# EAGLE design easyface (EAGLE 5.12)

## Sheet 1 of 2
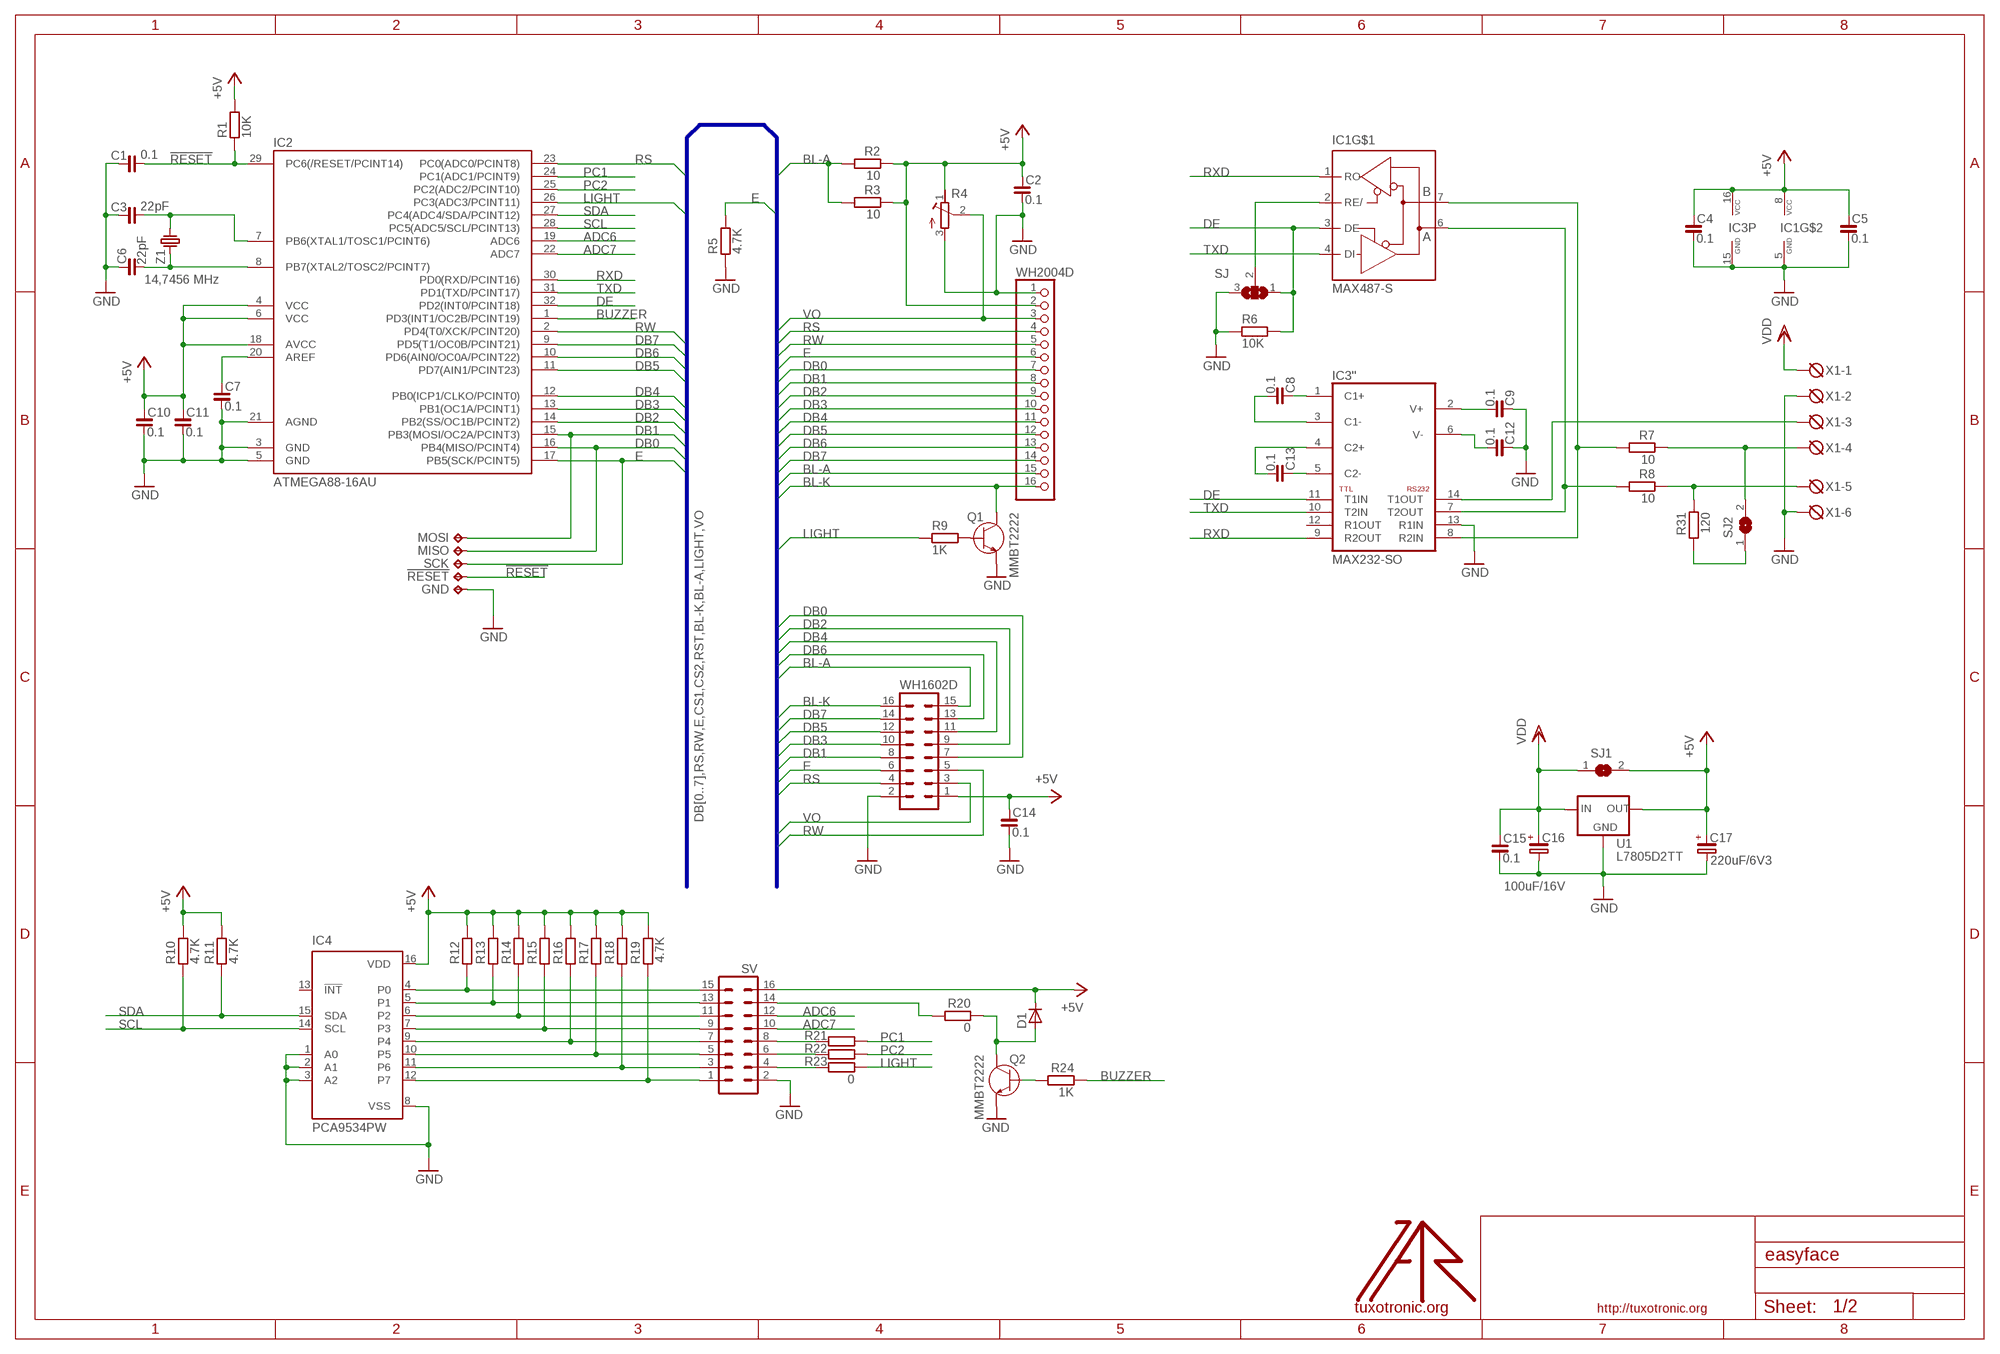
[diagram p0: schematic, sheet 1]

### Parts
!RESET  TPB1,27  [B1,27]
C1  0.1  C_0805  [C0805]
C2  0.1  C_0805  [C0805]
C3  22pF  C_0805  [C0805]
C4  0.1  C_0805  [C0805]
C5  0.1  C_0805  [C0805]
C6  22pF  C_0805  [C0805]
C7  0.1  C_0805  [C0805]
C8  0.1  C_0805  [C0805]
C9  0.1  C_0805  [C0805]
C10  0.1  C_0805  [C0805]
C11  0.1  C_0805  [C0805]
C12  0.1  C_0805  [C0805]
C13  0.1  C_0805  [C0805]
C14  0.1  C_0805  [C0805]
C15  0.1  C_0805  [C0805]
C16  100uF/16V  CP_SMCD  [SMC_D]
C17  220uF/6V3  CP_SMCD  [SMC_D]
D1  D-SOD-80  [SOD80]
GND  TPB1,27  [B1,27]
IC1  MAX487-S  [SO08]
IC2  ATMEGA88-16AU  MEGA48/88/168-AU  [TQFP32-08]
IC3  MAX232-SO  [SO16]
IC4  PCA9534PW  [SSOP16]
MISO  TPB1,27  [B1,27]
MOSI  TPB1,27  [B1,27]
Q1  MMBT2222  BC847C  [SOT23]
Q2  MMBT2222  BC847C  [SOT23]
R1  10K  R_0805  [R0805]
R2  10  R_0805  [R0805]
R3  10  R_0805  [R0805]
R4  RTRIM  [RTRIM-3362P]
R5  4.7K  R_0805  [R0805]
R6  10K  R_0805  [R0805]
R7  10  R_0805  [R0805]
R8  10  R_0805  [R0805]
R9  1K  R_0805  [R0805]
R10  4.7K  R_0805  [R0805]
R11  4.7K  R_0805  [R0805]
R12  4.7K  R_0805  [R0805]
R13  4.7K  R_0805  [R0805]
R14  4.7K  R_0805  [R0805]
R15  4.7K  R_0805  [R0805]
R16  4.7K  R_0805  [R0805]
R17  4.7K  R_0805  [R0805]
R18  4.7K  R_0805  [R0805]
R19  4.7K  R_0805  [R0805]
R20  0  R_0805  [R0805]
R21  0  R_0805  [R0805]
R22  0  R_0805  [R0805]
R23  0  R_0805  [R0805]
R24  1K  R_0805  [R0805]
R31  120  R_0805  [R0805]
SCK  TPB1,27  [B1,27]
SJ  SJ2W  [SJ_2]
SJ1  SJ  [SJ]
SJ2  SJ  [SJ]
SV  ML16L  [ML16L]
U1  L7805D2TT  L78D2TT  [D2PAK]
U$  LOGO  [TT_LOGO]
WH1602D  MA08-2  [MA08-2]
WH2004D  PINHD-1X16_2.54-RND  [1X16RND]
X1  DG3XX-06-3.5  [DG350-3.5-06P]
Z1  14,7456 MHz  CRYSTAL-HC49S  [HC49/S]

### Nets
!RESET: !RESET.PP(TP) C1.2 IC2.29(PC6(/RESET/PCINT14)) R1.1
+5V: C2.1 C4.1 C5.1 C10.1 C11.1 C14.1 C17.+ D1.C IC1.8(VCC) IC2.4(VCC) IC2.6(VCC) IC2.18(AVCC) IC3.16(P:VCC) IC4.16(VDD) R1.2 R2.1 R3.1 R4.1(A) R10.2 R11.2 R12.2 R13.2 R14.2 R15.2 R16.2 R17.2 R18.2 R19.2 SJ1.2 SV.16 U1.3(OUT) WH1602D.1 WH2004D.2
ADC6: IC2.19(ADC6) SV.12
ADC7: IC2.22(ADC7) SV.10
BL-A: R2.2 R3.2 WH1602D.15 WH2004D.15
BL-K: Q1.3(C) WH1602D.16 WH2004D.16
BUZZER: IC2.1(PD3(INT1/OC2B/PCINT19)) R24.1
DB0: IC2.16(PB4(MISO/PCINT4)) MISO.PP(TP) WH1602D.7 WH2004D.7
DB1: IC2.15(PB3(MOSI/OC2A/PCINT3)) MOSI.PP(TP) WH1602D.8 WH2004D.8
DB2: IC2.14(PB2(SS/OC1B/PCINT2)) WH1602D.9 WH2004D.9
DB3: IC2.13(PB1(OC1A/PCINT1)) WH1602D.10 WH2004D.10
DB4: IC2.12(PB0(ICP1/CLKO/PCINT0)) WH1602D.11 WH2004D.11
DB5: IC2.11(PD7(AIN1/PCINT23)) WH1602D.12 WH2004D.12
DB6: IC2.10(PD6(AIN0/OC0A/PCINT22)) WH1602D.13 WH2004D.13
DB7: IC2.9(PD5(T1/OC0B/PCINT21)) WH1602D.14 WH2004D.14
DE: IC1.3(DE) IC2.32(PD2(INT0/PCINT18)) IC3.11('':T1IN) R6.2 SJ.1
E: IC2.17(PB5(SCK/PCINT5)) R5.2 SCK.PP(TP) WH1602D.6 WH2004D.6
GND: C1.1 C2.2 C3.1 C4.2 C5.2 C6.1 C7.2 C9.1 C10.2 C11.2 C12.1 C14.2 C15.2 C16.- C17.- GND.PP(TP) IC1.5(GND) IC2.3(GND) IC2.5(GND) IC2.21(AGND) IC3.13('':R1IN) IC3.15(P:GND) IC4.1(A0) IC4.2(A1) IC4.3(A2) IC4.8(VSS) Q1.2(E) Q2.2(E) R4.3(E) R5.1 R6.1 SJ.3 SV.2 U1.2(GND) WH1602D.2 WH2004D.1 X1.2 X1.6 ; also sheet 2
LIGHT: IC2.26(PC3(ADC3/PCINT11)) R9.1 R23.1
N$1: R7.1 SJ2.2 X1.4
N$2: IC4.4(P0) R12.1 SV.15
N$3: C7.1 IC2.20(AREF)
N$4: IC1.2(RE/) SJ.2
N$5: IC4.5(P1) R13.1 SV.13
N$6: Q2.1(B) R24.2
N$7: IC4.6(P2) R14.1 SV.11
N$8: R20.2 SV.14
N$9: D1.A Q2.3(C) R20.1
N$10: IC4.7(P3) R15.1 SV.9
N$11: Q1.1(B) R9.2
N$12: IC4.9(P4) R16.1 SV.7
N$13: IC4.10(P5) R17.1 SV.5
N$14: IC4.11(P6) R18.1 SV.3
N$15: IC4.12(P7) R19.1 SV.1
N$16: C3.2 IC2.7(PB6(XTAL1/TOSC1/PCINT6)) Z1.2
N$17: R8.1 R31.1 X1.5
N$18: R21.2 SV.8
N$19: R22.2 SV.6
N$20: R23.2 SV.4
N$22: R31.2 SJ2.1
N$51: C12.2 IC3.6('':V-)
N$52: C9.2 IC3.2('':V+)
N$55: C13.1 IC3.5('':C2-)
N$56: C13.2 IC3.4('':C2+)
N$57: C8.2 IC3.3('':C1-)
N$58: C8.1 IC3.1('':C1+)
N$63: IC1.6(A) IC3.7('':T2OUT) R8.2
N$64: IC1.7(B) IC3.8('':R2IN) R7.2
N$65: IC3.14('':T1OUT) X1.3
PC1: IC2.24(PC1(ADC1/PCINT9)) R21.1
PC2: IC2.25(PC2(ADC2/PCINT10)) R22.1
RS: IC2.23(PC0(ADC0/PCINT8)) WH1602D.4 WH2004D.4
RW: IC2.2(PD4(T0/XCK/PCINT20)) WH1602D.5 WH2004D.5
RXD: IC1.1(RO) IC2.30(PD0(RXD/PCINT16)) IC3.9('':R2OUT)
SCL: IC2.28(PC5(ADC5/SCL/PCINT13)) IC4.14(SCL) R10.1
SDA: IC2.27(PC4(ADC4/SDA/PCINT12)) IC4.15(SDA) R11.1
TXD: IC1.4(DI) IC2.31(PD1(TXD/PCINT17)) IC3.10('':T2IN)
VDD: C15.1 C16.+ SJ1.1 U1.1(IN) X1.1
VO: R4.2(S) WH1602D.3 WH2004D.3
XTAL2: C6.2 IC2.8(PB7(XTAL2/TOSC2/PCINT7)) Z1.1
Unconnected: IC3.12('':R1OUT) IC4.13(!INT)

### Buses
DB[0..7],RS,RW,E,CS1,CS2,RST,BL-K,BL-A,LIGHT,VO

## Sheet 2 of 2
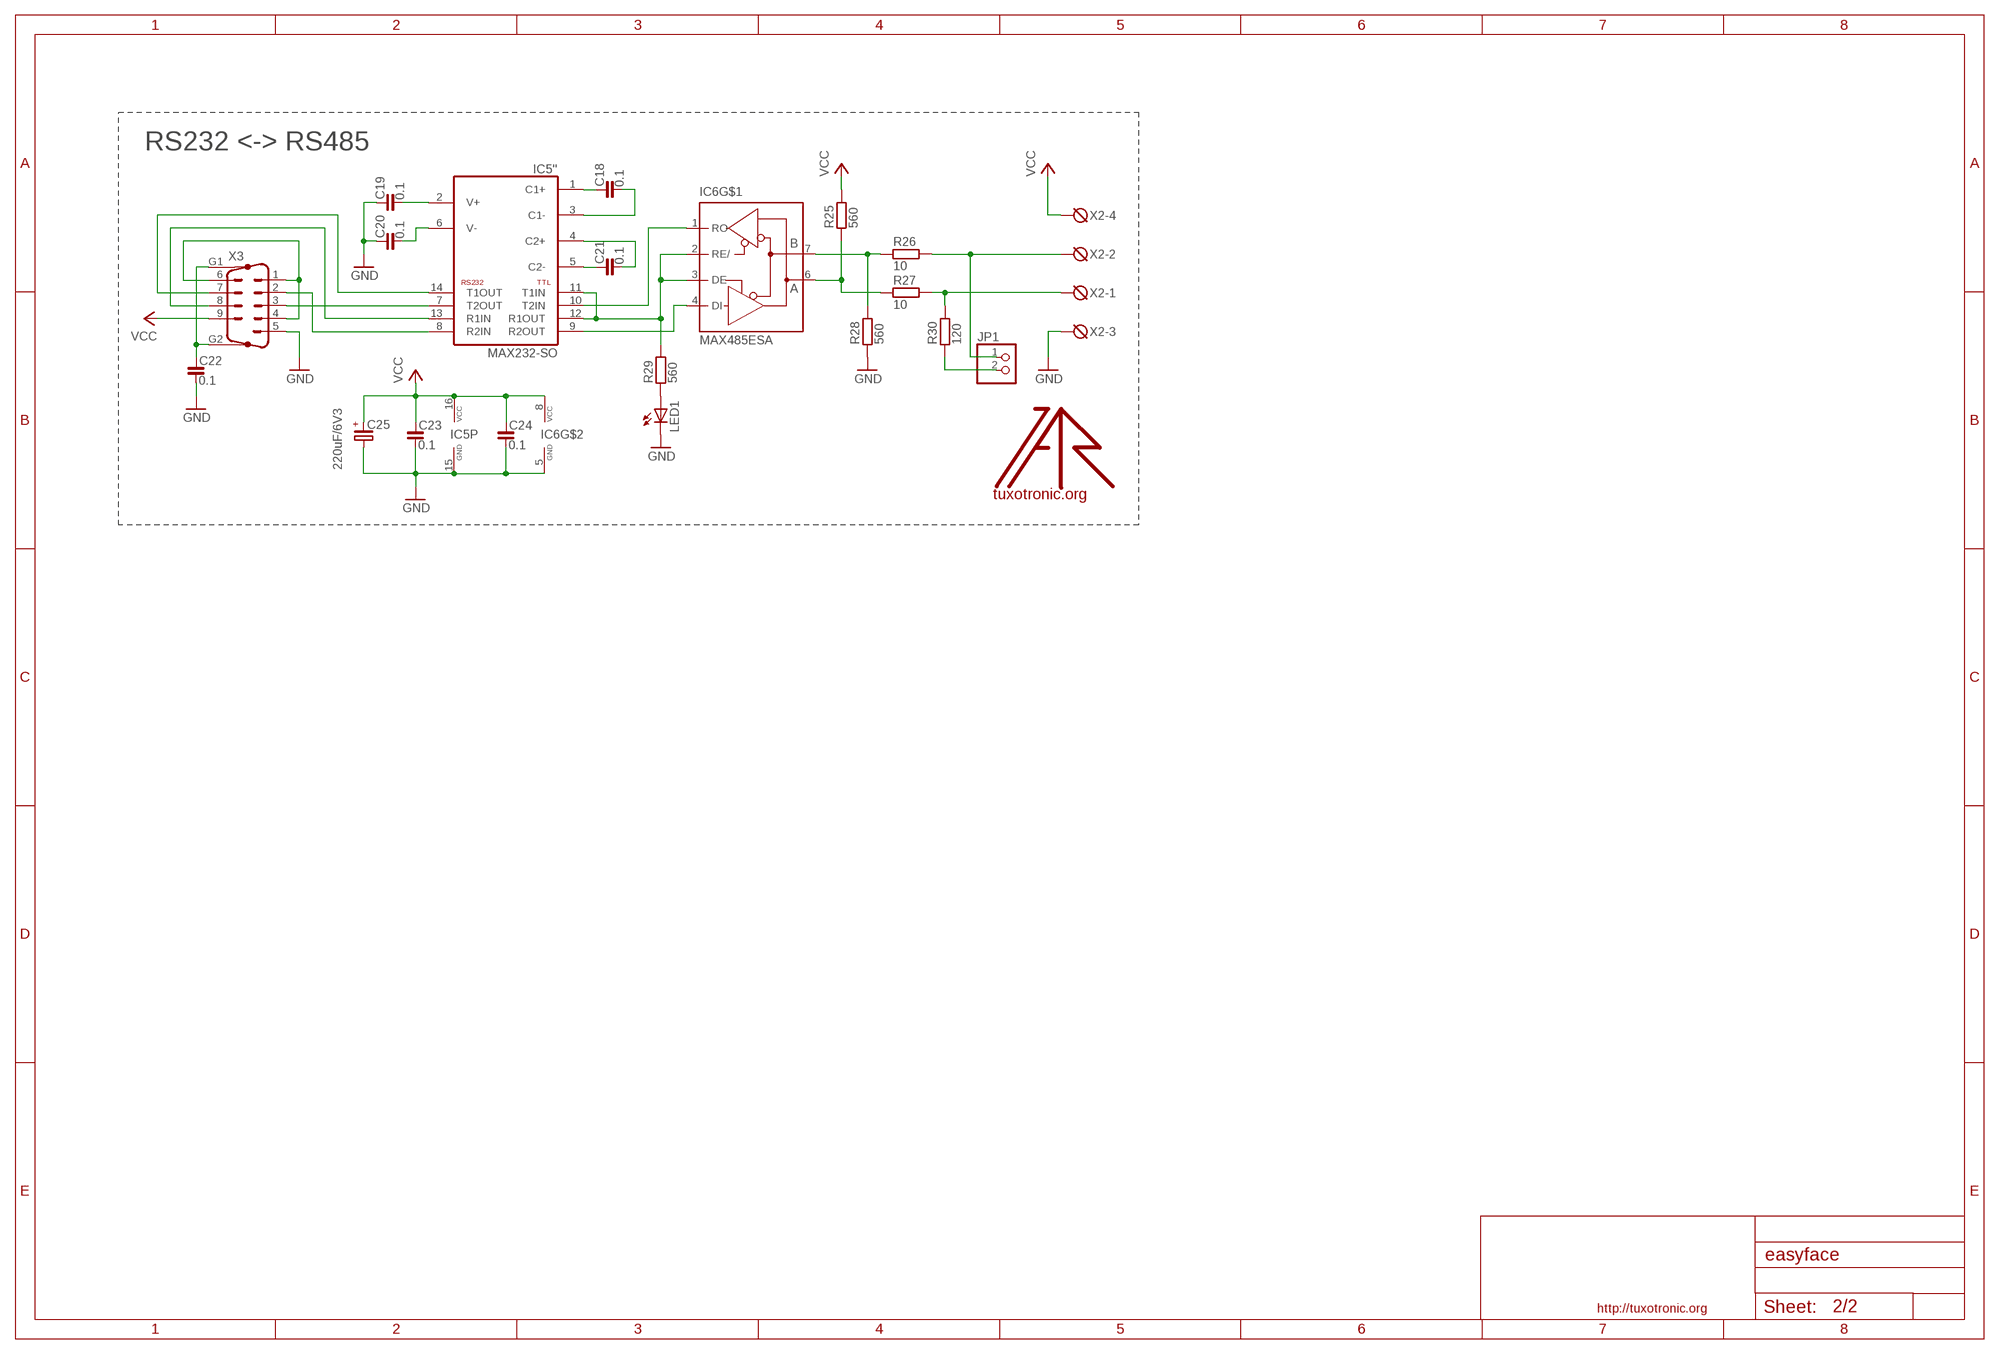
[diagram p1: schematic, sheet 2]

### Parts
C18  0.1  C_0805  [C0805]
C19  0.1  C_0805  [C0805]
C20  0.1  C_0805  [C0805]
C21  0.1  C_0805  [C0805]
C22  0.1  C_1206  [C1206]
C23  0.1  C_0805  [C0805]
C24  0.1  C_0805  [C0805]
C25  220uF/6V3  CP_SMCD  [SMC_D]
IC5  MAX232-SO  [SO16]
IC6  MAX485ESA  MAX487-S  [SO08]
JP1  PINHD-1X2_2.54  [1X02]
LED1  LEDCHIP-LED0805  [CHIP-LED0805]
R25  560  R_0805  [R0805]
R26  10  R_0805  [R0805]
R27  10  R_0805  [R0805]
R28  560  R_0805  [R0805]
R29  560  R_0805  [R0805]
R30  120  R_0805  [R0805]
U$1  LOGO  [TT_LOGO]
X2  DG3XX-04-3.5  [DG350-3.5-04P]
X3  M09HP-9.4  [M09HP]

### Nets
GND: C19.1 C20.1 C22.2 C23.2 C24.2 C25.- IC5.15(P:GND) IC6.5(GND) LED1.C R28.1 X2.3 X3.5 ; also sheet 1
N$21: JP1.2 R30.1
N$31: IC5.7('':T2OUT) X3.3
N$32: C20.2 IC5.6('':V-)
N$33: C19.2 IC5.2('':V+)
N$34: C22.1 X3.G1 X3.G2
N$35: X3.1 X3.4 X3.6
N$36: C21.1 IC5.5('':C2-)
N$37: C21.2 IC5.4('':C2+)
N$38: C18.2 IC5.3('':C1-)
N$39: C18.1 IC5.1('':C1+)
N$40: IC6.7(B) R26.1 R28.2
N$41: IC6.6(A) R25.1 R27.1
N$42: JP1.1 R26.2 X2.2
N$43: R27.2 R30.2 X2.1
N$44: IC5.8('':R2IN) X3.2
N$45: IC5.14('':T1OUT) X3.7
N$46: IC5.13('':R1IN) X3.8
N$48: IC5.9('':R2OUT) IC6.4(DI)
N$49: IC5.10('':T2IN) IC6.1(RO)
N$50: LED1.A R29.1
N$71: IC5.11('':T1IN) IC5.12('':R1OUT) IC6.2(RE/) IC6.3(DE) R29.2
VCC: C23.1 C24.1 C25.+ IC5.16(P:VCC) IC6.8(VCC) R25.2 X2.4 X3.9

### Notes on the sheet
- RS232 <-> RS485

## Library data of the parts
!RESET GND MISO MOSI SCK = testpad:TP: Test pad
C1-C15 C18-C24 = rc-master-smd:C_: NON-POLARIZED CAP
C16 C17 C25 = rc-master-smd:CP_: POLARIZED CAP
D1 = diodes:D-: DIODE
IC1 = interfaces:MAX487: RS485 TRANSEIVER
IC2 = avr-6:MEGA48/88/168
IC3 IC5 = rs232-rs485:MAX232: RS232 TRANSEIVER
IC4 = micro-philips:PCA9534: 8-bit I2C-bus and SMBus low power I/O port with interrupt
IC6 = rs232-rs485:MAX487: RS485 TRANSEIVER
JP1 = pinhead-fixdrills:PINHD-1X2: PIN HEADER
LED1 = led:LED: LED OSRAM: - CHIPLED LG R971, LG N971, LY N971, LG Q971, LY Q971, LO R971, LY R971 LH N974, LH R974 LS Q976, LO Q976, LY Q976 LO Q996 - Hyper CHIPLED LW Q18S LB Q993, LB Q99A, LB R99A - SideLED LS A670, LO A670, LY A670, LG A670, LP A670 LB A673, LV A673, LT A673, LW A673 LH A674 LY A675 LS A676, LA A676, LO A676, LY A676, LW A676 LS A679, LY A679, LG A679 - Hyper Micro SIDELED® LS Y876, LA Y876, LO Y876, LY Y876 LT Y87S - SmartLED LW L88C, LW L88S LB L89C, LB L89S, LG L890 LS L89K, LO L89K, LY L89K LS L896, LA L896, LO L896, LY L896 - TOPLED LS T670, LO T670, LY T670, LG T670, LP T670 LSG T670, LSP T670, LSY T670, LOP T670, LYG T670 LG T671, LOG T671, LSG T671 LB T673, LV T673, LT T673, LW T673 LH T674 LS T676, LA T676, LO T676, LY T676, LB T676, LH T676, LSB T676, LW T676 LB T67C, LV T67C, LT T67C, LS T67K, LO T67K, LY T67K, LW E67C LS E67B, LA E67B, LO E67B, LY E67B, LB E67C, LV E67C, LT E67C LW T67C LS T679, LY T679, LG T679 LS T770, LO T770, LY T770, LG T770, LP T770 LB T773, LV T773, LT T773, LW T773 LH T774 LS E675, LA E675, LY E675, LS T675 LS T776, LA T776, LO T776, LY T776, LB T776 LHGB T686 LT T68C, LB T68C - Hyper Mini TOPLED® LB M676 - Mini TOPLED Santana® LG M470 LS M47K, LO M47K, LY M47K Source: http://www.osram.convergy.de - LUMILED® LXK2-PW12-R00, LXK2-PW12-S00, LXK2-PW14-U00, LXK2-PW14-V00 LXK2-PM12-R00, LXK2-PM12-S00, LXK2-PM14-U00 LXK2-PE12-Q00, LXK2-PE12-R00, LXK2-PE12-S00, LXK2-PE14-T00, LXK2-PE14-U00 LXK2-PB12-K00, LXK2-PB12-L00, LXK2-PB12-M00, LXK2-PB14-N00, LXK2-PB14-P00, LXK2-PB14-Q00 LXK2-PR12-L00, LXK2-PR12-M00, LXK2-PR14-Q00, LXK2-PR14-R00 LXK2-PD12-Q00, LXK2-PD12-R00, LXK2-PD12-S00 LXK2-PH12-R00, LXK2-PH12-S00 LXK2-PL12-P00, LXK2-PL12-Q00, LXK2-PL12-R00 Source: www.luxeon.com
Q1 Q2 = semiconductor:BC847: Bipolar transistor NPN-structure
R1-R3 R5-R31 = rc-master-smd:R_: RESISTOR
R4 = lcd-char:RTRIM
SJ = discrete:SJ2W: SMD solder JUMPER
SJ1 SJ2 = discrete:SJ: SMD solder JUMPER
SV = con-ml:ML16L: HARTING
U1 = vreg-linear:L78: VOLTAGE REGULATOR
U$ U$1 = logo:LOGO
WH1602D = con-lstb:MA08-2: PIN HEADER
WH2004D = pinhead-fixdrills:PINHD-1X16: PIN HEADER
X1 = degson:DG3XX-06: DG350-3.5-06P DG306-5.0-06P
X2 = degson:DG3XX-04: DG350-3.5-04P DG306-5.0-04P
X3 = sub-d:M09HP: SUB-D
Z1 = discrete:CRYSTAL-: CRYSTAL

## Net classes
0 default: width 0.1 mm, drill 0.1 mm, clearance 0.1 mm

## Board
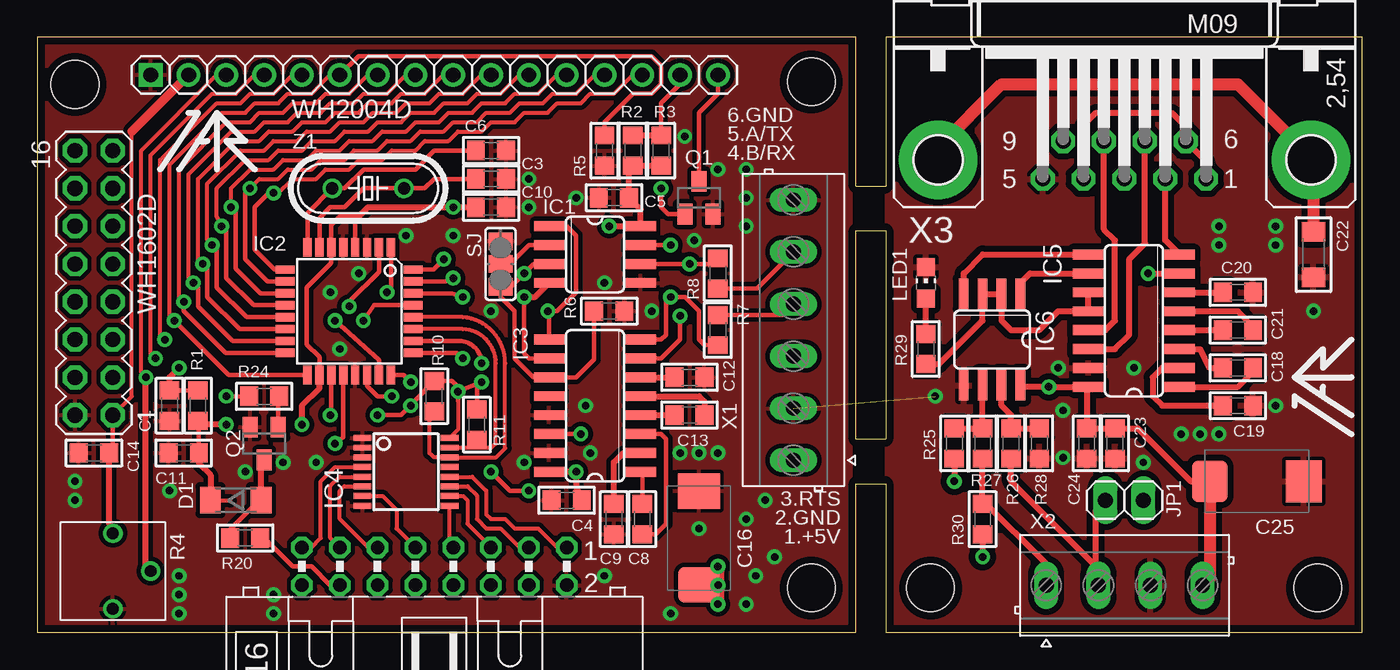
[diagram p2: board, top side]
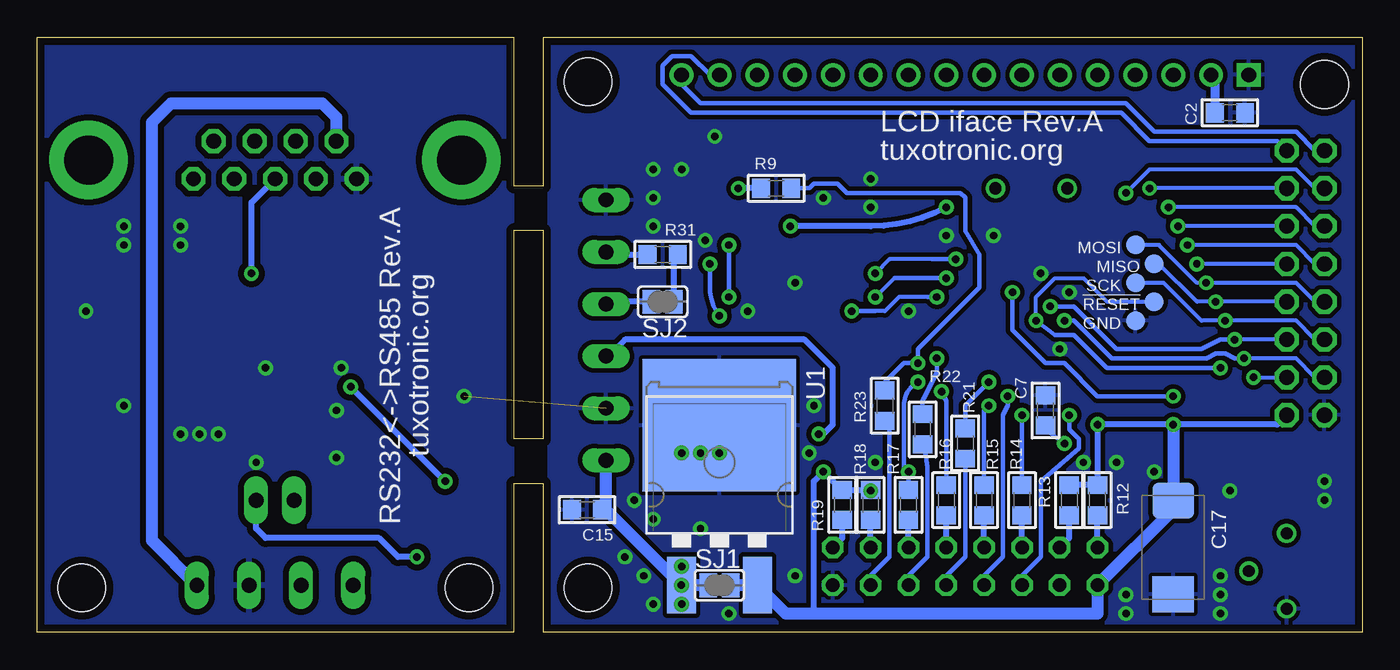
[diagram p3: board, bottom side, seen from below]

Size 89 x 40 mm. Coordinates in mm from the lower left corner, seen from the top.
Outline: 0,0 55,0 55,10 57,10 57,0 89,0 89,40 57,40 57,30 55,30 55,40 0,40 0,0
Outline: 55,13 55,27 57,27 57,13 55,13
Copper layers (1*16): Top 0.018mm / dielectric 1.5011mm / Bottom 0.018mm
Design rules "resonit-speed-18mkm": minimum track width 0.2mm, minimum drill 0.5mm, track to track 0.2mm, track to pad 0.2mm, pad to pad 0.2mm, via to via 0.2mm, smd to smd 0.2mm, copper to edge 0.5mm, drill to drill 8mil, minimum pad ring 0.2489mm, minimum via ring 0.2489mm, stop-mask expansion 4mil, vias tented up to drill 0.5994mm, thermal gap 10mil
Holes 3.2 mm at 2.54,36.83 52,3 52,37 60,3 86,3

### Footprints (pad centres in the part's own frame; a part is rotated, then mirrored left to right if it is on the bottom)
B1,27 = smd 1.27 x 1.27: PP 0,0
C0805 = smd 1.2 x 1.3: 1 -1.016,0; 2 1.016,0
SMC_D = smd 2.4 x 2.8: + -3.15,0; - 3.15,0
C1206 = smd 1.3 x 1.6: 1 -1.524,0; 2 1.524,0
SOD80 = smd 1.4 x 1.8: A 1.7,0; C -1.7,0
SO08 = smd 0.66 x 2.032: 1 -1.905,-3.073; 2 -0.635,-3.073; 3 0.635,-3.073; 4 1.905,-3.073; 5 1.905,3.073; 6 0.635,3.073; 7 -0.635,3.073; 8 -1.905,3.073
TQFP32-08 = smd 1.27 x 0.559: 1 -4.293,2.8; 2 -4.293,2; 3 -4.293,1.2; 4 -4.293,0.4; 5 -4.293,-0.4; 6 -4.293,-1.2; 7 -4.293,-2; 8 -4.293,-2.8; 17 4.293,-2.8; 18 4.293,-2; 19 4.293,-1.2; 20 4.293,-0.4; 21 4.293,0.4; 22 4.293,1.2; 23 4.293,2; 24 4.293,2.8 | smd 0.559 x 1.27: 9 -2.8,-4.293; 10 -2,-4.293; 11 -1.2,-4.293; 12 -0.4,-4.293; 13 0.4,-4.293; 14 1.2,-4.293; 15 2,-4.293; 16 2.8,-4.293; 25 2.8,4.293; 26 2,4.293; 27 1.2,4.293; 28 0.4,4.293; 29 -0.4,4.293; 30 -1.2,4.293; 31 -2,4.293; 32 -2.8,4.293
SO16 = smd 0.66 x 2.032: 1 -4.445,-3.073; 2 -3.175,-3.073; 3 -1.905,-3.073; 4 -0.635,-3.073; 5 0.635,-3.073; 6 1.905,-3.073; 7 3.175,-3.073; 8 4.445,-3.073; 9 4.445,3.073; 10 3.175,3.073; 11 1.905,3.073; 12 0.635,3.073; 13 -0.635,3.073; 14 -1.905,3.073; 15 -3.175,3.073; 16 -4.445,3.073
SSOP16 = smd 0.4 x 1.2: 1 -2.275,-2.925; 2 -1.625,-2.925; 3 -0.975,-2.925; 4 -0.325,-2.925; 5 0.325,-2.925; 6 0.975,-2.925; 7 1.625,-2.925; 8 2.275,-2.925; 9 2.275,2.925; 10 1.625,2.925; 11 0.975,2.925; 12 0.325,2.925; 13 -0.325,2.925; 14 -0.975,2.925; 15 -1.625,2.925; 16 -2.275,2.925
1X02 = drill 1 long: 1 -1.27,0; 2 1.27,0
CHIP-LED0805 = smd 1.2 x 1.2: A 0,-1.05; C 0,1.05
SOT23 = smd 1 x 1.4: 1 -0.95,-1.1; 2 0.95,-1.1; 3 0,1.1
R0805 = smd 1.2 x 1.3: 1 -1.016,0; 2 1.016,0
RTRIM-3362P = drill 0.8 round: 1 -2.54,0; 2 0,2.54; 3 2.54,0
SJ_2 = smd 1.168 x 1.6: 1 -1.524,0; 2 0,0; 3 1.524,0
SJ = smd 1.168 x 1.6: 1 -0.762,0; 2 0.762,0
ML16L = drill 0.9 octagon: 1 -8.89,-1.27; 2 -8.89,1.27; 3 -6.35,-1.27; 4 -6.35,1.27; 5 -3.81,-1.27; 6 -3.81,1.27; 7 -1.27,-1.27; 8 -1.27,1.27; 9 1.27,-1.27; 10 1.27,1.27; 11 3.81,-1.27; 12 3.81,1.27; 13 6.35,-1.27; 14 6.35,1.27; 15 8.89,-1.27; 16 8.89,1.27
D2PAK = smd 1.93 x 3.81: 1 -2.55,-8.25; 3 2.55,-8.25 | smd 10.3 x 8.9: 2 0,2.5
MA08-2 = drill 1.016 octagon: 1 -8.89,-1.27; 2 -8.89,1.27; 3 -6.35,-1.27; 4 -6.35,1.27; 5 -3.81,-1.27; 6 -3.81,1.27; 7 -1.27,-1.27; 8 -1.27,1.27; 9 1.27,-1.27; 10 1.27,1.27; 11 3.81,-1.27; 12 3.81,1.27; 13 6.35,-1.27; 14 6.35,1.27; 15 8.89,-1.27; 16 8.89,1.27
1X16RND = drill 1 square: 1 -19.05,0 | drill 1 round: 2 -16.51,0; 3 -13.97,0; 4 -11.43,0; 5 -8.89,0; 6 -6.35,0; 7 -3.81,0; 8 -1.27,0; 9 1.27,0; 10 3.81,0; 11 6.35,0; 12 8.89,0; 13 11.43,0; 14 13.97,0; 15 16.51,0; 16 19.05,0
DG350-3.5-06P = drill 1 long: 1 -8.75,0; 2 -5.25,0; 3 -1.75,0; 4 1.75,0; 5 5.25,0; 6 8.75,0
DG350-3.5-04P = drill 1 long: 1 -5.25,0; 2 -1.75,0; 3 1.75,0; 4 5.25,0
M09HP = drill 1 octagon: 1 -5.486,1.27; 2 -2.743,1.27; 3 0,1.27; 4 2.743,1.27; 5 5.486,1.27; 6 -4.115,-1.27; 7 -1.372,-1.27; 8 1.372,-1.27; 9 4.115,-1.27 | drill 3.3 pad 5.08 round: G1 -12.522,0; G2 12.522,0
HC49/S = drill 0.813 round: 1 -2.413,0; 2 2.413,0

### Placement (x,y rotation side)
!RESET  13.97,22.23 90 bottom
C1  8.89,15.24 90 top
C2  8.89,34.92 0 bottom
C3  30.48,30.48 180 top
C4  35.56,8.89 180 top
C5  38.73,29.21 180 top
C6  30.48,32.38 180 top
C7  21.27,14.92 90 bottom
C8  40.64,7.62 270 top
C9  38.73,7.62 90 top
C10  30.48,28.57 0 top
C11  9.84,12.06 180 top
C12  43.81,17.14 180 top
C13  43.81,14.61 180 top
C14  3.81,12.06 180 top
C15  52.07,8.26 180 bottom
C16  44.45,6.35 90 top
C17  12.7,5.71 270 bottom
C18  80.64,17.78 180 top
C19  80.64,15.24 180 top
C20  80.64,22.86 180 top
C21  80.64,20.32 180 top
C22  85.72,25.4 270 top
C23  72.39,12.7 270 top
C24  70.48,12.7 270 top
C25  81.92,10.16 0 top
D1  13.34,8.89 0 top
GND  15.24,20.95 90 bottom
IC1  37.47,25.4 270 top
IC2  20.95,21.59 270 top
IC3  37.47,15.24 90 top
IC4  24.77,10.79 270 top
IC5  73.66,20.95 90 top
IC6  64.14,19.68 180 top
JP1  73.03,8.89 0 top
LED1  59.69,23.5 0 top
MISO  13.97,24.77 90 bottom
MOSI  15.24,26.04 90 bottom
Q1  44.45,29.21 0 top
Q2  15.24,12.7 180 top
R1  10.79,15.24 270 top
R2  40.01,32.38 90 top
R3  41.91,32.38 90 top
R4  5.08,4.13 270 top
R5  38.1,32.38 90 top
R6  38.42,21.59 180 top
R7  45.72,20.32 270 top
R8  45.72,24.13 90 top
R9  39.37,29.84 180 bottom
R10  26.67,15.88 90 top
R11  29.53,13.97 90 top
R12  17.78,8.89 90 bottom
R13  19.68,8.89 90 bottom
R14  22.86,8.89 90 bottom
R15  25.4,8.89 90 bottom
R16  27.94,8.89 90 bottom
R17  30.48,8.57 90 bottom
R18  33.02,8.57 90 bottom
R19  34.92,8.57 90 bottom
R20  13.97,6.35 0 top
R21  26.67,12.7 270 bottom
R22  29.53,13.65 270 bottom
R23  32.07,15.24 270 bottom
R24  15.24,15.88 0 top
R25  61.59,12.7 270 top
R26  65.41,12.7 270 top
R27  63.5,12.7 270 top
R28  67.31,12.7 90 top
R29  59.69,19.05 270 top
R30  63.5,7.62 90 top
R31  46.99,25.4 0 bottom
SCK  15.24,23.5 90 bottom
SJ  31.11,24.77 90 top
SJ1  43.18,3.17 0 bottom
SJ2  46.99,22.23 180 bottom
SV  26.67,4.45 180 top
U1  43.18,11.43 0 bottom
U$  12.06,33.66 0 top
U$1  85.72,17.14 90 top
WH1602D  3.81,23.5 90 top
WH2004D  26.67,37.47 0 top
X1  50.8,20.32 90 top
X2  73.03,3.17 0 top
X3  73.03,31.75 180 top
Z1  22.23,29.84 0 top

### Tracks (layer width: path | path; a pad name or v marks a point on that pad's centre or on a via)
!RESET  (via drill 0.5)
  Top 0.305: C1.2 R1.1 | IC2.29 22.62,21.99 v21.91,20.95
  Top 0.406: v9.53,17.78 8.89,17.14 C1.2
  Bottom 0.254: !RESET.PP 17.14,22.23 18.73,23.81 20.64,23.81 21.91,22.54 v21.91,20.95
  Bottom 0.305: v9.53,17.78 17.14,17.78 19.37,20 20.64,20 v21.91,20.95
+5V  (via drill 0.5)
  Top 0.254: 6.35,33.66 6.35,15.88 WH1602D.1 | 28.26,15.56 28.26,13.64 IC4.16
  Top 0.305: WH1602D.1 5.08,12.32 C14.1 | IC2.18 18.95,18.51 18.1,19.37 18.1,23.18 19.75,24.84 IC2.6 19.75,27.38 20.32,27.94 21.27,27.94 21.36,27.86 IC2.4 | IC4.16 27.69,13.09 | C11.1 10.86,14.16 R1.2 | D1.C 12.95,8.84 | v28.26,16.19 28.26,15.56 | v28.26,16.19 28.26,16.26 | v28.26,16.19 28.26,16.51 27.88,16.89 R10.2 25.4,15.62 v25.08,15.24 24.45,14.61 v22.86,14.61 | v28.26,16.19 v29.84,16.83 29.53,16.51 R11.2 | v33.02,9.53 31.75,9.53 v30.48,10.79
  Top 0.406: R3.1 R2.1 39.75,31.11 C5.1 40.54,28.42 IC1.8 v38.42,27.3 | 21.27,27.94 21.59,27.94 22.23,28.57 v27.94,28.57 C10.1 | C14.1 4.83,7.37 R4.1 | IC3.16 v36.2,10.79 36.2,9.78 C4.1 | IC2.18 18.95,16.41 17.78,15.24 v17.78,13.97 | v12.7,13.97 11.05,13.97 R1.2 | D1.C 11.63,10.59 10.86,11.37 C11.1
  Top 0.61: 6.35,33.66 WH2004D.2
  Bottom 0.305: R16.2 27.94,15.56 v28.26,16.19 | v25.08,15.24 25.4,14.92 R15.2 | v22.86,14.61 R14.2 | R17.2 v30.48,10.79 30.8,11.11 30.8,15.24 arc62 v29.84,16.83 | R18.2 v33.02,9.53
  Bottom 0.406: R13.2 R12.2 v17.78,13.97 v12.7,13.97 5.71,13.97 WH1602D.1 | R18.2 R19.2 35.31,9.91 v36.2,10.79 36.83,10.16 36.83,1.27 | v38.42,27.3 33.02,27.3 arc-28 v27.94,28.57
  Bottom 0.61: C2.1 9.91,37.21 WH2004D.2
  Bottom 0.813: v12.7,13.97 C17.+ 12.7,8.26 SV.16 17.78,1.27 36.83,1.27 38.72,1.27 U1.3 SJ1.2
ADC6  (via drill 0.5)
  Top 0.305: IC2.19 19.75,14.68 v19.68,14.61
  Bottom 0.305: SV.12 22.86,3.81 21.59,5.08 21.59,10.16 19.05,12.38 19.05,13.02 19.68,13.65 v19.68,14.61
ADC7  (via drill 0.5)
  Top 0.305: v23.81,15.88 22.86,15.88 22.16,16.58 IC2.22
  Bottom 0.305: SV.10 25.4,3.81 24.13,5.08 24.13,14.61 23.81,15.24 v23.81,15.88
BL-A
  Top 0.305: WH2004D.15 43.18,36.83 41.91,35.56 R3.2
  Top 0.406: R3.2 R2.2
  Bottom 0.305: WH2004D.15 43.81,37.47 45.09,38.73 46.35,38.73 46.99,38.1 46.99,36.83 45.09,34.92 16.19,34.92 14.29,33.02 5.71,33.02 WH1602D.15
BL-K
  Top 0.305: Q1.3 44.45,34.92 45.72,36.2 WH2004D.16
  Bottom 0.305: WH1602D.16 3.17,32.38 4.45,33.66 13.97,33.66 15.88,35.56 44.45,35.56 45.72,36.83 WH2004D.16
BUZZER  (via drill 0.5)
  Top 0.305: R24.1 v12.7,15.88 | IC2.1 23.75,23.12 v23.5,22.86
  Bottom 0.305: v23.5,22.86 23.5,20.32 21.27,18.1 20,18.1 17.78,15.88 v12.7,15.88
DB0  (via drill 0.5)
  Top 0.254: WH2004D.7 22.23,37.47 20.95,36.2 19.37,36.2 18.73,35.56 17.14,35.56 16.51,34.92 14.92,34.92 14.29,34.29 12.7,34.29 9.53,31.11 9.53,22.54 v9.84,22.23
  Top 0.305: IC2.16 12.64,18.79 9.84,21.59 v9.84,22.23
  Bottom 0.254: WH1602D.7 v9.84,22.23 11.11,22.23 13.65,24.77 MISO.PP
DB1  (via drill 0.5)
  Top 0.254: WH2004D.8 24.77,37.47 23.5,36.2 21.91,36.2 21.27,35.56 19.68,35.56 19.05,34.92 17.46,34.92 16.83,34.29 15.24,34.29 14.61,33.66 13.02,33.66 10.16,30.8 10.16,23.81 v10.48,23.5
  Top 0.305: IC2.15 13.11,19.59 10.79,21.91 10.79,23.18 v10.48,23.5
  Bottom 0.254: WH1602D.8 3.17,22.23 4.45,23.5 v10.48,23.5 11.11,23.5 13.65,26.04 MOSI.PP
DB2  (via drill 0.5)
  Top 0.254: WH2004D.9 27.3,37.47 26.04,36.2 24.45,36.2 23.81,35.56 22.23,35.56 21.59,34.92 20,34.92 19.37,34.29 17.78,34.29 17.14,33.66 15.56,33.66 14.92,33.02 13.34,33.02 10.79,30.48 10.79,25.08 v11.11,24.77
  Top 0.305: IC2.14 13.58,20.39 11.43,22.54 11.43,24.45 v11.11,24.77
  Bottom 0.254: WH1602D.9 v11.11,24.77
DB3  (via drill 0.5)
  Top 0.254: WH2004D.10 29.84,37.47 28.57,36.2 26.99,36.2 26.35,35.56 24.77,35.56 24.13,34.92 22.54,34.92 21.91,34.29 20.32,34.29 19.68,33.66 18.1,33.66 17.46,33.02 15.88,33.02 15.24,32.38 13.65,32.38 11.43,30.16 11.43,26.35 v11.75,26.04
  Top 0.305: IC2.13 14.05,21.19 12.06,23.18 12.06,25.72 v11.75,26.04
  Bottom 0.254: v11.75,26.04 4.45,26.04 3.17,24.77 WH1602D.10
DB4  (via drill 0.5)
  Top 0.254: WH2004D.11 32.38,37.47 31.11,36.2 29.53,36.2 28.89,35.56 27.3,35.56 26.67,34.92 25.08,34.92 24.45,34.29 22.86,34.29 22.23,33.66 20.64,33.66 20,33.02 18.41,33.02 17.78,32.38 16.19,32.38 15.56,31.75 13.97,31.75 12.06,29.84 12.06,27.94 v12.38,27.3
  Top 0.305: IC2.12 14.52,21.99 12.7,23.81 12.7,26.99 v12.38,27.3
  Bottom 0.254: WH1602D.11 v12.38,27.3
DB5  (via drill 0.5)
  Top 0.254: WH2004D.12 34.92,37.47 33.66,36.2 32.07,36.2 31.43,35.56 29.84,35.56 29.21,34.92 27.62,34.92 26.99,34.29 25.4,34.29 24.77,33.66 23.18,33.66 22.54,33.02 20.95,33.02 20.32,32.38 18.73,32.38 18.1,31.75 16.51,31.75 15.88,31.11 14.29,31.11 13.02,29.84 v13.02,28.57
  Top 0.305: IC2.11 14.99,22.79 13.34,24.45 13.34,28.26 v13.02,28.57
  Bottom 0.254: v13.02,28.57 4.45,28.57 3.17,27.3 WH1602D.12
DB6  (via drill 0.5)
  Top 0.254: WH2004D.13 37.47,37.47 36.2,36.2 34.61,36.2 33.97,35.56 32.38,35.56 31.75,34.92 30.16,34.92 29.53,34.29 27.94,34.29 27.3,33.66 25.72,33.66 25.08,33.02 23.5,33.02 22.86,32.38 21.27,32.38 20.64,31.75 19.05,31.75 18.41,31.11 16.83,31.11 16.19,30.48 14.92,30.48 v14.29,29.84
  Top 0.305: IC2.10 15.46,23.59 13.97,25.08 13.97,29.53 v14.29,29.84
  Bottom 0.254: WH1602D.13 v14.29,29.84
DB7  (via drill 0.5)
  Top 0.254: WH2004D.14 40.01,37.47 38.73,36.2 37.15,36.2 36.51,35.56 34.92,35.56 34.29,34.92 32.7,34.92 32.07,34.29 30.48,34.29 29.84,33.66 28.26,33.66 27.62,33.02 26.04,33.02 25.4,32.38 23.81,32.38 23.18,31.75 21.59,31.75 20.95,31.11 19.37,31.11 18.73,30.48 17.14,30.48 16.19,29.53 v15.88,29.53
  Top 0.305: IC2.9 15.93,24.39 14.61,25.72 14.61,28.57 15.56,29.53 v15.88,29.53
  Bottom 0.254: v15.88,29.53 14.29,31.11 4.45,31.11 3.17,29.84 WH1602D.14
DE  (via drill 0.5)
  Top 0.305: IC2.32 26.61,24.39 v27.3,25.08 | R6.2 37.4,18.35 36.2,17.14 IC3.11 33.34,17.14 32.07,18.41 32.07,21.59 31.11,22.54 SJ.1 31.81,23.24 v32.7,24.13 33.34,24.77 IC1.3
  Bottom 0.254: 28.89,25.08 31.75,25.08 v32.7,24.13
  Bottom 0.305: v27.3,25.08 28.89,25.08
E  (via drill 0.5)
  Top 0.254: WH2004D.6 19.68,37.47 18.41,36.2 16.83,36.2 16.19,35.56 14.61,35.56 13.97,34.92 12.38,34.92 8.89,31.43 8.89,21.27 v9.21,20.95
  Top 0.305: IC2.17 12.87,17.3 v9.21,20.95 | R5.2 38.1,34.29 40.01,36.2 41.27,36.2 41.91,36.83 41.91,38.1 41.27,38.73 21.59,38.73 WH2004D.6
  Bottom 0.254: WH1602D.6 3.17,19.68 4.45,20.95 v9.21,20.95 10.79,20.95 13.34,23.5 SCK.PP
GND  (via drill 0.5)  (1 unrouted)
  other vias: 19.68,22.86 20.32,19.05 30.48,21.59 33.02,28.57 33.02,30.48 36.2,29.21 24.77,26.67 27.94,26.67 21.59,24.13 15.88,1.27 45.72,31.11 36.83,15.24 37.15,12.06 13.97,10.79 16.51,11.43 8.89,9.53 44.45,12.06 45.72,12.06 43.18,12.06 44.45,6.99 47.62,7.62 9.53,2.54 9.53,1.27 15.88,2.54 38.1,3.81 47.62,1.91 48.26,3.81 49.53,5.08 48.9,8.89 47.62,27.3 47.62,29.21 47.62,31.11 38.1,23.5 18.73,11.43 42.55,1.27 41.27,21.59 43.5,33.34 44.13,26.35 9.53,3.81 2.54,10.16 2.54,8.89 32.7,11.43 68.58,17.78 73.66,17.78 83.19,15.24 85.72,21.59 60.33,15.88 68.9,11.75 68.9,14.92 76.83,13.34 78.11,13.34 79.38,13.34 79.38,26.04 83.19,26.04 83.19,27.3 79.38,27.3 74.3,11.43
  pour Bottom (isolate 0.305): 0,40.01 54.61,40.01 54.61,0 0,0
  pour Top (isolate 0.305): 0,40.01 54.61,40.01 54.61,0 0,0
  pour Top (isolate 0.406): 57.15,40.01 89.53,40.01 89.53,0 57.15,0
  pour Bottom (isolate 0.406): 57.15,40.01 89.53,40.01 89.53,0 57.15,0
LIGHT  (via drill 0.5)
  Top 0.305: IC2.26 28.35,19.59 arc-90 v29.84,18.1
  Bottom 0.305: R23.1 32.07,16.83 30.8,18.1 v29.84,18.1 29.84,19.05 25.72,23.18 25.72,25.4 26.67,26.99 26.67,29.21 26.99,29.53 34.61,29.53 35.24,30.16 36.83,30.16 37.15,29.84 R9.1
N$1
  Top 0.305: R7.1 50.07,21.34 X1.4
  Bottom 0.406: SJ2.2 50.65,22.23 X1.4
N$2
  Top 0.254: IC4.4 20.01,11.12 19.05,10.16 19.05,6.35 18.41,5.71 SV.15
  Bottom 0.406: SV.15 R12.1
N$3  (via drill 0.5)
  Top 0.305: IC2.20 20.55,13.1 v20,12.7
  Bottom 0.305: C7.1 21.27,13.65 v20,12.7
N$4
  Top 0.305: SJ.2 31.75,24.77 33.02,26.04 IC1.2
N$5
  Top 0.254: IC4.5 20.31,10.47 19.68,9.84 19.68,6.35 SV.13
  Bottom 0.406: R13.1 19.68,6.35 SV.13
N$6
  Top 0.305: Q2.1 16.19,15.81 R24.2
N$7
  Top 0.254: IC4.6 20.61,9.82 20.32,9.53 20.32,7.62 22.23,5.71 SV.11
  Bottom 0.406: SV.11 R14.1
N$8
  Top 0.305: SV.14 19.68,3.17 18.41,4.45 17.14,4.45 15.24,6.35 R20.2
N$9
  Top 0.305: R20.1 12.95,6.92 14.92,8.89 D1.A
  Top 0.406: D1.A 15.04,11.39 Q2.3
N$10
  Top 0.254: IC4.7 23.21,9.17 24.13,8.26 24.13,6.99 SV.9
  Bottom 0.406: SV.9 R15.1
N$11  (via drill 0.5)
  Top 0.305: v41.91,29.84 41.91,28.57 42.38,28.11 Q1.1
  Bottom 0.406: R9.2 v41.91,29.84
N$12
  Top 0.254: IC4.9 27.69,5.96 SV.7
  Bottom 0.406: SV.7 R16.1
N$13
  Top 0.254: IC4.10 28.61,9.17 28.89,8.89 28.89,7.3 SV.5
  Bottom 0.406: SV.5 R17.1
N$14
  Top 0.254: IC4.11 28.91,9.82 29.53,9.21 29.53,7.62 30.16,6.99 31.11,6.99 32.38,5.71 SV.3
  Bottom 0.406: SV.3 R18.1
N$15
  Top 0.254: IC4.12 29.22,10.47 30.16,9.53 30.16,7.94 30.48,7.62 31.43,7.62 32.07,6.99 33.66,6.99 34.92,5.71 SV.1
  Bottom 0.406: R19.1 34.92,6.35 SV.1
N$16
  Top 0.305: C3.2 26.67,30.48 26.04,29.84 Z1.2 21.91,29.84 20.64,28.57 19.68,28.57 18.95,27.84 IC2.7
N$17
  Top 0.305: R8.1 48.34,23.11 X1.5
  Bottom 0.406: R31.1 50.63,25.4 X1.5
N$18
  Bottom 0.305: SV.8 27.94,3.81 26.67,5.08 R21.2
N$19
  Bottom 0.305: SV.6 30.48,3.81 29.21,5.08 29.21,10.79 arc-20 R22.2
N$20
  Bottom 0.305: SV.4 33.02,3.81 31.75,5.08 31.75,13.91 R23.2
N$21  (via drill 0.5)
  Top 0.406: R30.1 v63.5,5.08
  Bottom 0.406: v63.5,5.08 64.77,5.08 66.04,6.35 73.66,6.35 74.3,6.99 JP1.2
N$22
  Bottom 0.406: SJ2.1 46.23,25.15 R31.2
N$31  (via drill 0.5)
  Top 0.406: v74.61,24.13 IC5.7
  Bottom 0.406: v74.61,24.13 74.61,28.89 X3.3
N$32
  Top 0.406: IC5.6 C20.2
N$33
  Top 0.406: C19.2 75.56,15.24 74.93,15.88 74.93,17.14 75.56,17.78 IC5.2
N$34
  Top 0.813: C22.1 85.72,31.57 X3.G1 85.55,31.93 80.64,36.83 64.77,36.83 60.5,32.56 X3.G2
N$35
  Top 0.406: X3.4 70.28,34.09 71.12,34.92 76.2,34.92 77.14,33.98 X3.6 78.51,31.65 X3.1
N$36
  Top 0.406: IC5.5 80.64,21.59 81.66,20.57 C21.1
N$37
  Top 0.406: IC5.4 C21.2
N$38
  Top 0.406: IC5.3 78.11,19.05 78.74,17.78 C18.2
N$39
  Top 0.406: IC5.1 80.64,16.51 81.66,17.53 C18.1
N$40
  Top 0.406: IC6.7 64.77,15.24 65.41,14.61 R26.1 R28.2
N$41
  Top 0.406: R25.1 R27.1 IC6.6
N$42
  Top 0.406: R26.2 65.41,10.16 71.12,4.45 | 71.12,4.45 71.12,3.33 X2.2 | 71.12,4.45 71.12,8.26 JP1.1
N$43
  Top 0.406: 63.5,8.89 R27.2 | X2.1 67.78,4.62 63.5,8.89 | 63.5,8.89 R30.2
N$44
  Top 0.406: X3.2 75.77,26.36 IC5.8
N$45
  Top 0.406: X3.7 74.4,26.14 73.34,25.08 73.34,20 72.39,19.05 IC5.14
N$46
  Top 0.406: X3.8 71.65,27.09 72.39,26.35 72.39,20.95 71.75,20.32 IC5.13
N$48
  Top 0.406: IC5.9 63.5,25.4 62.23,24.13 IC6.4
N$49
  Top 0.406: IC5.10 66.67,24.13 66.04,23.5 IC6.1
N$50
  Top 0.406: R29.1 LED1.A
N$51
  Top 0.406: IC3.6 C12.2
N$52
  Top 0.406: C9.2 38.73,11.43 39.37,12.06 IC3.2
N$55
  Top 0.406: IC3.5 44.45,15.88 44.83,15.49 C13.1
N$56
  Top 0.406: IC3.4 C13.2
N$57
  Top 0.305: IC3.3 41.91,13.34 42.23,13.02 42.23,7.3 41.53,6.6 C8.2
N$58
  Top 0.305: C8.1 40.64,10.69 IC3.1
N$63  (via drill 0.5)
  Top 0.305: IC1.6 v43.81,24.77 45.34,24.77 R8.2 | IC3.7 41.91,18.41 43.18,19.68 v43.18,21.27
  Bottom 0.305: v43.81,24.77 43.81,23.18 arc-37 v43.18,21.27
N$64  (via drill 0.5)
  Top 0.305: v42.55,26.04 IC1.7 | IC3.8 41.91,19.68 42.23,20 42.23,22.23 v42.55,22.54 43.5,22.54 44.45,21.59 44.45,19.68 44.83,19.3 R7.2
  Bottom 0.305: v42.55,22.54 v42.55,26.04
N$65  (via drill 0.5)
  Top 0.305: IC3.14 v36.51,13.34
  Bottom 0.406: v36.51,13.34 36.2,13.34 35.56,13.97 35.56,17.78 37.47,19.68 49.53,19.68 50.65,18.57 X1.3
N$71
  Top 0.406: IC5.11 IC5.12 68.58,21.59 67.31,20.32 65.41,20.32 64.77,20.95 IC6.2 IC6.3 63.5,20.95 60.58,18.03 R29.2
PC1  (via drill 0.5)
  Top 0.305: 24.77,17.14 v25.08,16.83 24.61,17.3 IC2.24
  Bottom 0.305: v25.08,16.83 26.67,15.24 R21.1
PC2  (via drill 0.5)
  Top 0.305: IC2.25 28.2,18.79 v28.57,18.41
  Bottom 0.305: v28.57,18.41 28.57,17.46 29.53,15.56 R22.1
RS  (via drill 0.5)
  Top 0.254: WH2004D.4 14.61,37.47 13.34,36.2 11.75,36.2 7.62,32.07 7.62,18.73 v7.94,18.41
  Top 0.305: IC2.23 22.95,18.32 v20,20.95
  Bottom 0.254: v7.94,18.41 4.45,18.41 3.17,17.14 WH1602D.4
  Bottom 0.305: v20,20.95 19.37,20.95 16.83,18.41 10.48,18.41 9.84,18.73 9.21,18.73 8.57,18.41 v7.94,18.41
RW  (via drill 0.5)
  Top 0.254: WH2004D.5 17.14,37.47 15.88,36.2 14.29,36.2 13.65,35.56 12.06,35.56 8.26,31.75 8.26,20 v8.57,19.68
  Top 0.305: IC2.2 22.95,24.23 20.95,22.23 v20.95,21.91
  Bottom 0.254: WH1602D.5 v8.57,19.68
  Bottom 0.305: v20.95,21.91 19.37,21.91 16.51,19.05 10.79,19.05 9.53,19.68 v8.57,19.68
RXD  (via drill 0.5)
  Top 0.305: IC2.30 27.87,22.79 v28.57,22.54 | IC1.1 35.56,27.3 36.2,26.67 36.2,22.86 34.92,21.59 v34.29,21.59 34.39,21.49 IC3.9
  Bottom 0.254: 32.7,21.59 32.07,21.59 31.11,22.54 29.21,22.54
  Bottom 0.305: v28.57,22.54 29.21,22.54 | 32.7,21.59 v34.29,21.59
SCL
  Top 0.254: IC2.28 28.57,21.19 arc-85 31.43,18.1 31.43,12.38 30.82,11.77 IC4.14 26.65,11.77 26.35,12.06 26.35,14.22 R10.1
SDA
  Top 0.254: IC4.15 29.21,12.42 | 29.21,12.42 30.52,12.42 30.8,12.7 30.8,18.1 arc88 28.57,20.39 IC2.27 | R11.1 29.53,12.74 29.21,12.42
TXD  (via drill 0.5)
  Top 0.305: IC2.31 27.4,23.59 v27.94,23.81 | v32.7,22.54 32.7,18.73 33.02,18.41 IC3.10
  Top 0.406: v32.7,22.54 33.44,22.54 IC1.4
  Bottom 0.254: 31.43,23.81 v32.7,22.54
  Bottom 0.305: v27.94,23.81 31.43,23.81
VCC  (via drill 0.5)
  Top 0.406: IC6.8 66.14,16.51 v67.94,16.51 IC5.16 70.48,16.41 C24.1 C23.1 73.91,13.72 77.47,10.16 C25.+ | R25.2 v61.59,10.16
  Top 0.813: C25.+ 78.77,3.67 X2.4
  Bottom 0.406: v61.59,10.16 v67.94,16.51
  Bottom 0.813: X3.9 68.91,34.62 69.85,35.56 80.01,35.56 81.28,34.29 81.28,6.18 X2.4
VDD  (via drill 0.5)
  Top 0.813: C16.+ 45.71,3.2 U1.1 | v45.72,4.45 v45.72,1.91
  Bottom 0.406: 50.8,8.26 C15.1
  Bottom 0.813: 46.35,3.81 50.8,8.26 X1.1 | U1.1 SJ1.1 | U1.1 46.35,3.81 | U1.1 | 46.35,3.81 v45.72,4.45
  other vias: 45.73,3.18
VO  (via drill 0.5)
  Top 0.254: WH2004D.3 12.06,37.47 6.99,32.38 6.99,17.46 v7.3,17.14
  Top 0.406: R4.2 7.3,4.13 v7.3,17.14
  Bottom 0.254: v7.3,17.14 WH1602D.3
XTAL2
  Top 0.305: C6.2 26.67,32.38 25.4,31.11 21.91,31.11 20.64,29.84 Z1.1 18.16,28.19 IC2.8

### Text on the board
tPlace: 6.GND | 5.A/TX | 4.B/RX | 3.RTS | 2.GND | 1.+5V
bPlace: LCD iface Rev.A | tuxotronic.org | RS232<->RS485 Rev.A | tuxotronic.org